# Altium project M1.PrjPcb
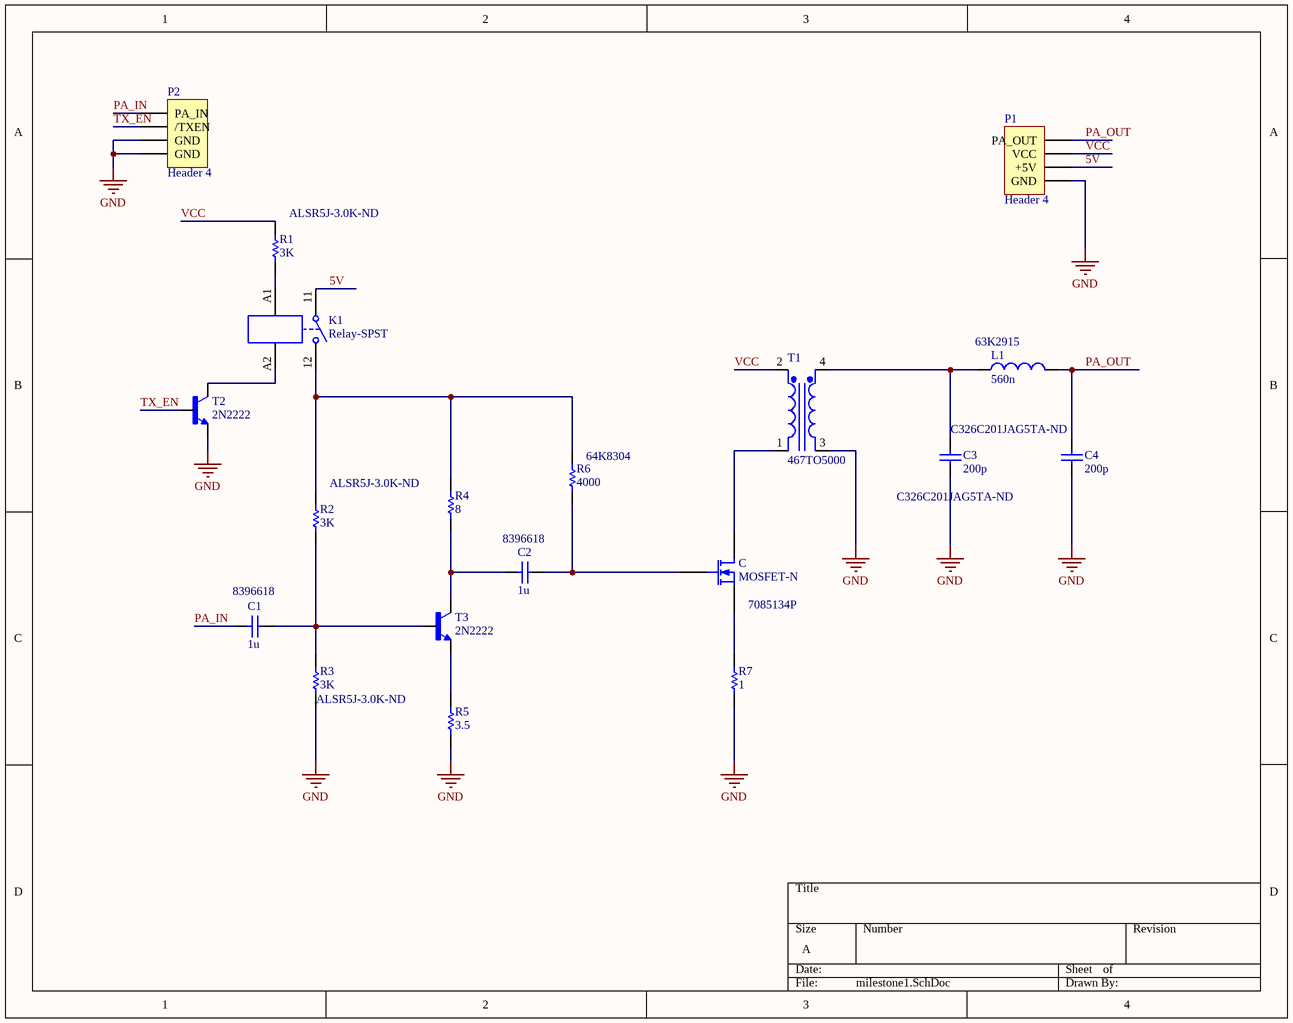
[diagram p0: milestone1.SchDoc]
1 sheet, 19 parts. Net scope: global (net labels, ports and power ports of the same name join across sheets).
Board file: PCB1.PcbDoc

## Sheet milestone1.SchDoc
size A; SheetNumber: 1; SheetTotal: 1

### Parts
C  MOSFET-N  Supplier Part Number 1: 7085134P  [TO254P1067X483X3124-3P]
C1  value 1u  Supplier Part Number 2: 8396618  [RAD-0.1]  (hidden comment: Capacitor 5)
C2  value 1u  Supplier Part Number 1: 8396618  [RAD-0.1]  (hidden comment: Capacitor 4)
C3  value 200p  Supplier Part Number 1: C326C201JAG5TA-ND  [rad-0.1]  (hidden comment: Capacitor 1)
C4  value 200p  Supplier Part Number 1: C326C201JAG5TA-ND  [rad-0.1]  (hidden comment: Capacitor 2)
K1  Relay-SPST  [PCBComponent_1]
L1  value 560n  Supplier Part Number 2: 63K2915  [AXIAL-0.4]  (hidden comment: Inductor)
P1  Header 4  [HDR1X4]
P2  Header 4  [HDR1X4]
R1  value 3K  Supplier Part Number 2: ALSR5J-3.0K-ND  [AXIAL-0.4]  (hidden comment: Resistor 3)
R2  value 3K  Supplier Part Number 2: ALSR5J-3.0K-ND  [AXIAL-0.4]  (hidden comment: Resistor 3)
R3  value 3K  Supplier Part Number 3: ALSR5J-3.0K-ND  [AXIAL-0.4]  (hidden comment: Resistor 5)
R4  value 8  [rad-0.1]  (hidden comment: Resistor 8)
R5  value 3.5  [rad-0.1]  (hidden comment: Resistor 6)
R6  value 4000  Supplier Part Number 3: 64K8304  [AXIAL-0.4]  (hidden comment: Resistor 2)
R7  value 1  [AXIAL-0.4]  (hidden comment: Resistor 7)
T1  467TO5000  [TRANS]
T2  2N2222  [TO92-EBC-OVAL]
T3  2N2222  [TO92-EBC-OVAL]

### Nets
GND: C3.1 C4.1 P1.1(GND) P2.3(GND) P2.4(GND) R3.1 R5.1 R7.1 T1.3(Sec-) T2.E
5V: K1.11(SW1) P1.2(+5V)
PA_IN: C1.1 P2.1(PA_IN)
PA_OUT: C4.2 L1.2 P1.4(PA_OUT)
TX_EN: P2.2(/TXEN) T2.B
VCC: P1.3(VCC) R1.2 T1.2(Pri+)
NetC1_2: C1.2 R2.1 R3.2 T3.B
NetC2_1: C2.1 R4.1 T3.C
NetC3_2: C3.2 L1.1 T1.4(Sec+)
NetC_1: C.1(D) T1.1(Pri-)
NetC_2: C.2(G) C2.2 R6.1
NetC_3: C.3(S) R7.2
NetK1_12: K1.12(SW2) R2.2 R4.2 R6.2
NetK1_A1: K1.A1(Coil1) R1.1
NetK1_A2: K1.A2(Coil2) T2.C
NetR5_2: R5.2 T3.E

### Library data of the parts
C = MOSFET-N: IRF510PBF N-channel MOSFET Transistor; 5.6 A; 100 V; 3-Pin TO-220AB; Manufacturer: Vishay; Rise Time: 16ns; Continuous Drain Current (ID): 5.6A; Drain to Source Resistance: 540mR; Power Dissipation: 43W; Gate to Source Voltage (Vgs): 20V; Fall Time: 9.4ns; Turn-Off Delay Time: 15ns; Element Configuration: Single; Input Capacitance: 180pF; Drain to Source Breakdown Voltage: 100V; Turn-On Delay Time: 6.9ns; Number of Elements: 1; Nominal Vgs: 4V; Recovery Time: 200ns; Polarization: N; Published: 8-Jun-2000; LatestRevisionDate: 17-Jul-2002; LatestRevisionNote: Re-released for DXP Platform.; PackageVersion: 1995/1996; PackageReference: E3; Publisher: Altium Limited; PackageDescription: TO, Flat Index; 3 In-Line, Axial Leads; Body Dia. 4.6mm; Lead Dia. 0.5 mm (max); Supplier 1: RSComponents; Manufacturer Part Number: IRF510PBF; RoHS: Yes; Category: MOSFETs; Stock 1: 1; Pricing 1: 10=1.10000, 100=0.68800, 250=0.64700, 1000=0.50100 (USD); Mount: Through Hole; Case/Package: TO-220AB; Number of Pins: 3; Weight: 0.211644oz; Contact Plating: Tin,Matte; Min Operating Temperature: -55°C; Max Operating Temperature: 175°C; Packaging: Rail/Tube; Package Quantity: 50; Max Power Dissipation: 43W; Polarity: N-CHANNEL; Rds On Max: 540mR; Drain to Source Voltage (Vdss): 100V; Number of Channels: 1; Voltage Rating (DC): 100V; Current Rating: 5.6A; On-State Resistance: 540mR; Drain-source On Resistance-Max: 540mR; Threshold Voltage: 4V; Length: 10.41mm; Width: 4.7mm; Height: 9.01mm; Radiation Hardening: No; RoHS Compliant: Yes; Lead Free: Lead Free; REACH SVHC: Unknown; ComponentLink1URL: https://datasheet.ciiva.com/8114/sihf510-8114656.pdf?src-supplier=Avnet; ComponentLink1Description: https://datasheet.ciiva.com/8114/sihf510-8114656.pdf?src-supplier=Avnet; ComponentLink2URL: https://datasheet.ciiva.com/14110/chirf510-data-en-14110759.pdf?src-supplier=Distrelec; ComponentLink2Description: https://datasheet.ciiva.com/14110/chirf510-data-en-14110759.pdf?src-supplier=Distrelec; ComponentLink3URL: https://datasheet.ciiva.com/15137/getdatasheetpartid-84718-15137579.pdf?src-supplier=Verical; ComponentLink3Description: https://datasheet.ciiva.com/15137/getdatasheetpartid-84718-15137579.pdf?src-supplier=Verical; ComponentLink4URL: https://datasheet.ciiva.com/933/sihf510-933818.pdf?src-supplier=Digi-Key; ComponentLink4Description: https://datasheet.ciiva.com/933/sihf510-933818.pdf?src-supplier=Digi-Key; ComponentLink5URL: https://datasheet.ciiva.com/18432/70078850-18432459.pdf?src-supplier=Allied+Electronics; ComponentLink5Description: https://datasheet.ciiva.com/18432/70078850-18432459.pdf?src-supplier=Allied+Electronics
C1 = Capacitor: Alum. Electrolytic Cap 1µF 50V 5mm Radial WCAP-ATG5 Series Lifetime 2000h +105°C; Manufacturer: CDE Illinois Capacitor; Manufacturer Part Number: 109CKS016M; SimulationGenericComponent: True; ESR (Equivalent Series Resistance): 56mR; Capacitance: 10mF; Voltage Rating: 16V; Tolerance: 20%; Polarity: Polar; Ripple Current: 3.23A; Life (Hours): 2000Hour; Dissipation Factor: 0.34%; Lead Length: 15mm; Supplier 1: Digi-Key; RoHS: Yes; Category: Aluminum Electrolytic Capacitors; Stock 1: 433; Pricing 1: 1=2.76000, 10=2.23600, 50=1.95140, 100=1.70740, 500=1.30088, 1000=1.13827, 2500=1.09762, 5000=1.06050 (USD); Mount: Through Hole,PCB; Case/Package: Radial; Min Operating Temperature: -40°C; Max Operating Temperature: 85°C; Package Quantity: 50; Packaging: Bulk; Voltage Rating (DC): 16V; Series: CKS; Termination: Through Hole; Diameter: 0.5mm; Length: 1.4inch; Height: 35.5mm; Lead Pitch: 0.295inch; Height - Seated (Max): 1.437inch; RoHS Compliant: Yes; Lead Free: Lead Free; ComponentLink1URL: https://datasheet.ciiva.com/16322/ckr-cks-16322429.pdf?src-supplier=Future+Electronics; ComponentLink1Description: https://datasheet.ciiva.com/16322/ckr-cks-16322429.pdf?src-supplier=Future+Electronics; ComponentLink2URL: https://datasheet.ciiva.com/14591/70111676-14591656.pdf?src-supplier=Allied+Electronics; ComponentLink2Description: https://datasheet.ciiva.com/14591/70111676-14591656.pdf?src-supplier=Allied+Electronics; Supplier 2: RSComponents; Stock 2: 1; Pricing 2: 50=0.09200, 250=0.06600, 500=0.05200, 1000=0.05000 (USD); REACH SVHC: Unknown; ComponentLink3URL: http://www.farnell.com/datasheets/1879647.pdf?src-supplier=Farnell; ComponentLink3Description: http://www.farnell.com/datasheets/1879647.pdf?src-supplier=Farnell; ComponentLink4URL: http://katalog.we-online.de/pbs/datasheet/860020672005.pdf?src-supplier=Digi-Key; ComponentLink4Description: http://katalog.we-online.de/pbs/datasheet/860020672005.pdf?src-supplier=Digi-Key; ComponentLink5URL: https://katalog.we-online.de/pbs/datasheet/860020672005.pdf?src-supplier=Digi-Key; ComponentLink5Description: https://katalog.we-online.de/pbs/datasheet/860020672005.pdf?src-supplier=Digi-Key; ComponentLink6URL: http://www.farnell.com/datasheets/1879647.pdf?src-supplier=Element14; ComponentLink6Description: http://www.farnell.com/datasheets/1879647.pdf?src-supplier=Element14
C2 = Capacitor: Alum. Electrolytic Cap 1µF 50V 5mm Radial WCAP-ATG5 Series Lifetime 2000h +105°C; Manufacturer: Wurth Electronics; Manufacturer Part Number: 860020672005; SimulationGenericComponent: True; Polarity: Polar; Ripple Current: 13mA; Life (Hours): 2000Hour; Tolerance: 20%; Capacitance: 1uF; Supplier 1: RSComponents; RoHS: Yes; Category: Aluminum Electrolytic Capacitors; Stock 1: 1; Pricing 1: 50=0.09200, 250=0.06600, 500=0.05200, 1000=0.05000 (USD); Mount: Through Hole; Case/Package: Radial; Min Operating Temperature: -40°C; Max Operating Temperature: 105°C; Package Quantity: 2000; Packaging: Tape and Reel; Voltage Rating: 50V; Voltage Rating (DC): 50V; Diameter: 5mm; Height: 11mm; Lead Pitch: 0.079inch; Height - Seated (Max): 0.492inch; REACH SVHC: Unknown; RoHS Compliant: Yes; ComponentLink1URL: http://www.farnell.com/datasheets/1879647.pdf?src-supplier=Farnell; ComponentLink1Description: http://www.farnell.com/datasheets/1879647.pdf?src-supplier=Farnell; ComponentLink2URL: http://katalog.we-online.de/pbs/datasheet/860020672005.pdf?src-supplier=Digi-Key; ComponentLink2Description: http://katalog.we-online.de/pbs/datasheet/860020672005.pdf?src-supplier=Digi-Key; ComponentLink3URL: https://katalog.we-online.de/pbs/datasheet/860020672005.pdf?src-supplier=Digi-Key; ComponentLink3Description: https://katalog.we-online.de/pbs/datasheet/860020672005.pdf?src-supplier=Digi-Key; ComponentLink4URL: http://www.farnell.com/datasheets/1879647.pdf?src-supplier=Element14; ComponentLink4Description: http://www.farnell.com/datasheets/1879647.pdf?src-supplier=Element14
C3 C4 = Capacitor: Capacitor Multi-layer Ceramic 200pF 5% 250V 2-Pin Through Hole Bulk; Manufacturer: KEMET; Manufacturer Part Number: C326C201JAG5TA; SimulationGenericComponent: True; Supplier 1: Digi-Key; RoHS: Yes; Category: Ceramic Capacitors; Stock 1: 1712; Pricing 1: 1=0.43000, 10=0.30000, 50=0.21020, 100=0.18020, 500=0.13514, 1000=0.11411, 2500=0.10811, 5000=0.10210 (USD); RoHS Compliant: Yes
K1 = Relay-SPST: Single-Pole Single-Throw Relay; Published: 24-Mar-1999; LatestRevisionDate: 17-Jul-2002; LatestRevisionNote: Re-released for DXP Platform.; PackageReference: MODULE4; Publisher: Altium Limited
L1 = Inductor: SimulationGenericComponent: True; Supplier 1: Newark; Supplier 2: Newark
P1 P2 = Header 4: Header, 4-Pin; LatestRevisionDate: 17-Jul-2002; LatestRevisionNote: Re-released for DXP Platform.; Publisher: Altium Limited
R1-R3 = Resistor: Res Wirewound 3K Ohm 5% 5W ±30ppm/°C Ceramic Hi Temp Sil AXL Thru-Hole Bulk; Manufacturer: Vishay BCcomponents; Manufacturer Part Number: MBA02040C3001FC100; TC1: 0; SimulationGenericComponent: True; Resistance: 3kR; Tolerance: 1%; Temperature Coefficient: 50ppm/°C; Power Rating: 400mW; Lead Length: 38.1mm; TC2: 0; Supplier 1: RSComponents; RoHS: Yes; Category: Through-Hole Resistors; Stock 1: 1; Pricing 1: 100=0.13400, 500=0.12500, 1000=0.11500, 2500=0.10600, 5000=0.09200 (USD); Mount: Through Hole; Case/Package: Axial; Contact Plating: Tin; Min Operating Temperature: -55°C; Max Operating Temperature: 155°C; Resistor Type: Thin Film; Packaging: Tape and Reel; Number of Terminations: 2; Termination: Axial; Max Power Dissipation: 400mW; Features: Automotive AEC-Q200; Series: MBA 0204 - Professional; Construction: Cylindrical; Diameter: 1.6mm; Length: 3.6mm; Radiation Hardening: No; Military Standard: Not; Lead Free: Lead Free; RoHS Compliant: Yes; ComponentLink1URL: http://www.alliedelec.com/m/d/72a9b4b9281933b6a3b8fa3f9583e3eb.pdf?src-supplier=Allied+Electronics; ComponentLink1Description: http://www.alliedelec.com/m/d/72a9b4b9281933b6a3b8fa3f9583e3eb.pdf?src-supplier=Allied+Electronics; ComponentLink2URL: http://uk.rs-online.com/webdocs/09bb/0900766b809bb010.pdf?src-supplier=RSComponents; ComponentLink2Description: http://uk.rs-online.com/webdocs/09bb/0900766b809bb010.pdf?src-supplier=RSComponents; ComponentLink3URL: http://components.arrow.com/part/dataview/0323_01833110?src-supplier=Arrow+Europe; ComponentLink3Description: http://components.arrow.com/part/dataview/0323_01833110?src-supplier=Arrow+Europe; ComponentLink4URL: http://www.vishay.com/docs/28766/28766.pdf?src-supplier=Avnet; ComponentLink4Description: http://www.vishay.com/docs/28766/28766.pdf?src-supplier=Avnet; ComponentLink5URL: http://www.vishay.com/docs/28766/mbxsma.pdf?src-supplier=Digi-Key; ComponentLink5Description: http://www.vishay.com/docs/28766/mbxsma.pdf?src-supplier=Digi-Key; ComponentLink6URL: http://www.vishay.com/docs/28766/28766.pdf?src-supplier=Avnet+Europe; ComponentLink6Description: http://www.vishay.com/docs/28766/28766.pdf?src-supplier=Avnet+Europe; Supplier 2: Digi-Key; Stock 2: 53; Pricing 2: 1=1.57000, 10=1.38900, 25=1.28760, 50=1.21200, 100=1.06050, 250=0.90900, 500=0.75750, 1000=0.65650, 5000=0.63630 (USD); Package Quantity: 1; Width: 7.92mm; ComponentLink7URL: https://datasheet.ciiva.com/2723/alsralvr-2723471.pdf?src-supplier=Digi-Key; ComponentLink7Description: https://datasheet.ciiva.com/2723/alsralvr-2723471.pdf?src-supplier=Digi-Key; ComponentLink8URL: https://datasheet.ciiva.com/8837/alsralvr-8837660.pdf?src-supplier=Avnet; ComponentLink8Description: https://datasheet.ciiva.com/8837/alsralvr-8837660.pdf?src-supplier=Avnet
  R3: Supplier 3: Digi-Key; Stock 3: 53; Pricing 3: 1=1.57000, 10=1.38900, 25=1.28760, 50=1.21200, 100=1.06050, 250=0.90900, 500=0.75750, 1000=0.65650, 5000=0.63630 (USD)
R4 = Resistor: Resistor; Wirewound; Res 33 Ohms; Pwr-Rtg 5 W; Tol 1%; Axial; Silicone-Ceramic; Manufacturer: Piher; Manufacturer Part Number: N6S25T0C-504-3030; TC1: 0; SimulationGenericComponent: True; Voltage Rating: 460V; Power Rating: 5W; Resistance: 33R; Temperature Coefficient: 20ppm/°C; TC2: 0; Supplier 1: Digi-Key; RoHS: No; Stock 1: 1473; Pricing 1: 1=0.48000, 10=0.44800, 25=0.40000, 50=0.38640, 100=0.35870, 250=0.35184, 500=0.32424, 1000=0.27595, 5000=0.22766 (USD); Supplier 2: Newark; Category: Through-Hole Resistors; Stock 2: 2; Pricing 2: 1=1.74000, 10=1.54000, 25=1.42000, 50=1.34000, 100=1.11000, 500=0.81100 (USD); Mount: Through Hole; Case/Package: Axial; Number of Pins: 2; Min Operating Temperature: 25°C; Max Operating Temperature: 275°C; Tolerance: 1%; Package Quantity: 25; Packaging: Bulk; Resistor Type: Wirewound; Number of Terminations: 2; Termination: Axial; Max Power Dissipation: 5W; Voltage Rating (DC): 460V; Series: Ohmicone® 40; Resistance Tolerance: 1%; Diameter: 8.7mm; Length: 23.8mm; REACH SVHC: Unknown; Lead Free: Lead Free; RoHS Compliant: Yes; ComponentLink1URL: https://datasheet.ciiva.com/2762/res-40-2762276.pdf?src-supplier=Digi-Key; ComponentLink1Description: https://datasheet.ciiva.com/2762/res-40-2762276.pdf?src-supplier=Digi-Key; ComponentLink2URL: https://datasheet.ciiva.com/5632/40-series-5632314.pdf?src-supplier=Mouser; ComponentLink2Description: https://datasheet.ciiva.com/5632/40-series-5632314.pdf?src-supplier=Mouser; ComponentLink3URL: https://datasheet.ciiva.com/15771/40-series-15771879.pdf?src-supplier=Onlinecomponents.com; ComponentLink3Description: https://datasheet.ciiva.com/15771/40-series-15771879.pdf?src-supplier=Onlinecomponents.com; ComponentLink4URL: https://datasheet.ciiva.com/16770/70022288-16770455.pdf?src-supplier=Allied+Electronics; ComponentLink4Description: https://datasheet.ciiva.com/16770/70022288-16770455.pdf?src-supplier=Allied+Electronics
R5 = Resistor: Res Metal Film 1.5 Ohm 5% 3W ±300ppm/°C Conformal AXL Thru-Hole; Manufacturer: Vishay Dale; Manufacturer Part Number: RN70C2700BB14; TC1: 0; SimulationGenericComponent: True; Resistance: 270R; Power Rating: 500mW; Tolerance: 0.1%; Voltage Rating: 500V; Temperature Coefficient: 50ppm/°C; Max Power Dissipation: 750mW; Resistance Tolerance: 1%; Lead Diameter: 1mm; Voltage Rating (DC): 350V; TC2: 0; Supplier 1: Digi-Key; RoHS: No; Category: Through-Hole Resistors; Stock 1: 944; Pricing 1: 1=1.69000, 10=1.49700, 25=1.38800, 50=1.30660, 100=1.14320, 250=0.97992, 500=0.81658, 1000=0.70771, 5000=0.68593 (USD); Mount: Through Hole; Case/Package: Axial; Min Operating Temperature: -65°C; Max Operating Temperature: 175°C; Packaging: Bulk; Package Quantity: 1000; Resistor Type: Metal Film; Termination: Axial; Number of Terminations: 2; Features: Moisture Resistant,Military,Flame Retardant Coating; Series: Military, MIL-R-10509/3, RN70; Length: 0.562inch; Width: 4.57mm; Lead Free: Contains Lead; RoHS Compliant: No; ComponentLink1URL: https://datasheet.ciiva.com/13978/cmfmil-13978011.pdf?src-supplier=Digi-Key; ComponentLink1Description: https://datasheet.ciiva.com/13978/cmfmil-13978011.pdf?src-supplier=Digi-Key; ComponentLink2URL: https://datasheet.ciiva.com/5491/cmfmil-223788-5491367.pdf?src-supplier=Mouser; ComponentLink2Description: https://datasheet.ciiva.com/5491/cmfmil-223788-5491367.pdf?src-supplier=Mouser; Supplier 2: Newark; Stock 2: 72; Pricing 2: 1=1.72000, 10=1.52000, 25=1.38000, 50=1.25000, 100=1.11000, 250=0.93100 (USD); Weight: 0.103oz; Diameter: 7.5mm; REACH SVHC: Unknown; ComponentLink3URL: https://datasheet.ciiva.com/6531/res-wh-wn-6531174.pdf?src-supplier=Digi-Key; ComponentLink3Description: https://datasheet.ciiva.com/6531/res-wh-wn-6531174.pdf?src-supplier=Digi-Key; ComponentLink4URL: https://datasheet.ciiva.com/6531/res-wh-wn-6531177.pdf?src-supplier=Digi-Key; ComponentLink4Description: https://datasheet.ciiva.com/6531/res-wh-wn-6531177.pdf?src-supplier=Digi-Key; ComponentLink5URL: https://datasheet.ciiva.com/5635/res-wh-wn-5635678.pdf?src-supplier=Mouser; ComponentLink5Description: https://datasheet.ciiva.com/5635/res-wh-wn-5635678.pdf?src-supplier=Mouser; ComponentLink6URL: https://datasheet.ciiva.com/46641/70370918-46641144.pdf?src-supplier=Allied+Electronics; ComponentLink6Description: https://datasheet.ciiva.com/46641/70370918-46641144.pdf?src-supplier=Allied+Electronics; ComponentLink7URL: https://datasheet.ciiva.com/8080/whm-wnm-8080265.pdf?src-supplier=Element14; ComponentLink7Description: https://datasheet.ciiva.com/8080/whm-wnm-8080265.pdf?src-supplier=Element14; Supplier 3: Newark; Stock 3: 72; Pricing 3: 1=1.72000, 10=1.52000, 25=1.38000, 50=1.25000, 100=1.11000, 250=0.93100 (USD); Supplier 4: Digi-Key; Stock 4: 3000; Pricing 4: 1500=0.12659, 3000=0.12207 (USD); Contact Plating: Tin; Construction: Cylindrical; Radiation Hardening: No; Military Standard: Not; ComponentLink8URL: https://media.digikey.com/pdf/Data%20Sheets/Panasonic%20Resistors%20Thermistors%20PDFs/ERX_GxS_F_Series.pdf?src-supplier=Digi-Key; ComponentLink8Description: https://media.digikey.com/pdf/Data%20Sheets/Panasonic%20Resistors%20Thermistors%20PDFs/ERX_GxS_F_Series.pdf?src-supplier=Digi-Key; ComponentLink9URL: http://components.arrow.com/part/dataview/43049225S455696N1386?src-supplier=Arrow+Electronics; ComponentLink9Description: http://components.arrow.com/part/dataview/43049225S455696N1386?src-supplier=Arrow+Electronics; ComponentLink10URL: http://www.mouser.com/ds/2/315/panasonic_aoa0000ce18-327359.pdf?src-supplier=Mouser; ComponentLink10Description: http://www.mouser.com/ds/2/315/panasonic_aoa0000ce18-327359.pdf?src-supplier=Mouser; ComponentLink11URL: http://www.onlinecomponents.com/datasheet/erx-3sj1r5a.aspx?p=44474898&src-supplier=Onlinecomponents.com; ComponentLink11Description: http://www.onlinecomponents.com/datasheet/erx-3sj1r5a.aspx?p=44474898&src-supplier=Onlinecomponents.com; ComponentLink12URL: http://industrial.panasonic.com/www-data/pdf/AOA0000/AOA0000CE18.pdf?src-supplier=Avnet; ComponentLink12Description: http://industrial.panasonic.com/www-data/pdf/AOA0000/AOA0000CE18.pdf?src-supplier=Avnet
R6 = Resistor: Resistor, Wirewound, Res 4 Kilohms, Pwr-Rtg 5 W, Tol 5%, Axial, Vitreous Enamel; Manufacturer: Piher; Manufacturer Part Number: N6S25T0C-504-3030; TC1: 0; SimulationGenericComponent: True; Resistance: 5kR; Power Rating: 5W; Tolerance: 1%; Temperature Coefficient: 20ppm/°C; Lead Diameter: 1mm; Voltage Rating: 330V; Voltage Rating (AC): 4V; TC2: 0; Supplier 1: Digi-Key; RoHS: No; Stock 1: 1473; Pricing 1: 1=0.48000, 10=0.44800, 25=0.40000, 50=0.38640, 100=0.35870, 250=0.35184, 500=0.32424, 1000=0.27595, 5000=0.22766 (USD); Supplier 2: Newark; Category: Through-Hole Resistors; Stock 2: 106; Pricing 2: 1=1.70000, 10=1.52000, 25=1.40000, 50=1.28000, 100=1.16000, 250=0.99000 (USD); Case/Package: Axial; Weight: 0.080848oz; Min Operating Temperature: -55°C; Max Operating Temperature: 150°C; Packaging: Tape and Reel; Package Quantity: 1; Resistor Type: Wirewound; Number of Terminations: 2; Termination: Axial; Max Power Dissipation: 5W; Series: WH; Resistance Tolerance: 1%; Diameter: 7.5mm; Length: 20mm; REACH SVHC: Unknown; RoHS Compliant: Yes; ComponentLink1URL: https://datasheet.ciiva.com/5635/res-wh-wn-5635721.pdf?src-supplier=Mouser; ComponentLink1Description: https://datasheet.ciiva.com/5635/res-wh-wn-5635721.pdf?src-supplier=Mouser; ComponentLink2URL: https://datasheet.ciiva.com/46365/7whm-wnm-46365913.pdf?src-supplier=Onlinecomponents.com; ComponentLink2Description: https://datasheet.ciiva.com/46365/7whm-wnm-46365913.pdf?src-supplier=Onlinecomponents.com; ComponentLink3URL: https://datasheet.ciiva.com/8080/whm-wnm-8080253.pdf?src-supplier=Element14; ComponentLink3Description: https://datasheet.ciiva.com/8080/whm-wnm-8080253.pdf?src-supplier=Element14; ComponentLink4URL: https://datasheet.ciiva.com/46641/70370918-46641133.pdf?src-supplier=Allied+Electronics; ComponentLink4Description: https://datasheet.ciiva.com/46641/70370918-46641133.pdf?src-supplier=Allied+Electronics; Supplier 3: Newark; Stock 3: 6; Pricing 3: 1=2.48000, 10=2.20000, 25=2.19000, 50=1.93000, 100=1.67000, 500=1.19000 (USD); Mount: Through Hole; Number of Pins: 2; Voltage Rating (DC): 330V; Features: Flame Retardant Coating; Lead Free: Lead Free; ComponentLink5URL: https://datasheet.ciiva.com/2723/res-20-2723908.pdf?src-supplier=Digi-Key; ComponentLink5Description: https://datasheet.ciiva.com/2723/res-20-2723908.pdf?src-supplier=Digi-Key; ComponentLink6URL: https://datasheet.ciiva.com/5631/20-series-5631871.pdf?src-supplier=Mouser; ComponentLink6Description: https://datasheet.ciiva.com/5631/20-series-5631871.pdf?src-supplier=Mouser; ComponentLink7URL: https://datasheet.ciiva.com/15769/20-series-15769433.pdf?src-supplier=Onlinecomponents.com; ComponentLink7Description: https://datasheet.ciiva.com/15769/20-series-15769433.pdf?src-supplier=Onlinecomponents.com; ComponentLink8URL: https://datasheet.ciiva.com/16722/70022261-16722174.pdf?src-supplier=Allied+Electronics; ComponentLink8Description: https://datasheet.ciiva.com/16722/70022261-16722174.pdf?src-supplier=Allied+Electronics
R7 = Resistor: Res Wirewound 8K Ohm 5% 5W ±30ppm/°C Ceramic Hi Temp Sil AXL Thru-Hole Bulk; Manufacturer: Vishay Dale; Manufacturer Part Number: RN55C8001BB14; TC1: 0; SimulationGenericComponent: True; Resistance: 8kR; Tolerance: 0.1%; Power Rating: 100mW; Voltage Rating: 200V; Temperature Coefficient: 50ppm/°C; Max Power Dissipation: 125mW; Lead Diameter: 0.64mm; Lead Length: 38.1mm; TC2: 0; Supplier 1: Digi-Key; RoHS: No; Category: Through-Hole Resistors; Stock 1: 229; Pricing 1: 1=0.79000, 10=0.69000, 25=0.60640, 50=0.55400, 100=0.48090, 250=0.41816, 500=0.34706, 1000=0.28224, 5000=0.26928 (USD); Mount: Through Hole; Case/Package: Axial; Contact Plating: Tin,Lead; Min Operating Temperature: -65°C; Max Operating Temperature: 175°C; Packaging: Bulk; Package Quantity: 100; Resistor Type: Metal Film; Termination: Axial; Number of Terminations: 2; Features: Moisture Resistant,Military,Flame Retardant Coating; Series: Military, MIL-R-10509/7, RN55; Diameter: 2.29mm; Length: 0.24inch; Width: 2.29mm; Military Standard: MIL-R-10509; Lead Free: Contains Lead; RoHS Compliant: No; ComponentLink1URL: https://datasheet.ciiva.com/13962/cmfmil-13962430.pdf?src-supplier=Digi-Key; ComponentLink1Description: https://datasheet.ciiva.com/13962/cmfmil-13962430.pdf?src-supplier=Digi-Key; Supplier 2: Digi-Key; Stock 2: 117; Pricing 2: 1=1.57000, 10=1.38900, 25=1.28760, 50=1.21200, 100=1.06050, 250=0.90900, 500=0.75750, 1000=0.65650, 5000=0.63630 (USD); ComponentLink2URL: https://datasheet.ciiva.com/8799/alsralvr-8799886.pdf?src-supplier=Avnet; ComponentLink2Description: https://datasheet.ciiva.com/8799/alsralvr-8799886.pdf?src-supplier=Avnet; ComponentLink3URL: https://datasheet.ciiva.com/2723/alsralvr-2723452.pdf?src-supplier=Digi-Key; ComponentLink3Description: https://datasheet.ciiva.com/2723/alsralvr-2723452.pdf?src-supplier=Digi-Key
T1 = Trans Ideal: Transformer (Ideal); Published: 8-Jun-2000; LatestRevisionDate: 17-Jul-2002; LatestRevisionNote: Re-released for DXP Platform.; PackageReference: TRF_4; Publisher: Altium Limited; PackageDescription: Transformer; 4 Leads
T2 T3 = 2N2222: Bipolar (BJT) Transistor NPN 40V 800mA 300MHz 500mW Through Hole TO-18; MF: ON Semiconductor; Price: None; Availability: In Stock; Purchase-URL: https://pricing.snapeda.com/search/part/2N2222/?ref=eda; Package: TO-18 Central Semiconductor; SnapEDA_Link: https://www.snapeda.com/parts/2N2222/Onsemi/view-part/?ref=snap; Value: *; MP: 2N2222; Check_prices: https://www.snapeda.com/parts/2N2222/Onsemi/view-part/?ref=eda